# Altium schematic sheet Sheet2.SchDoc
size A0
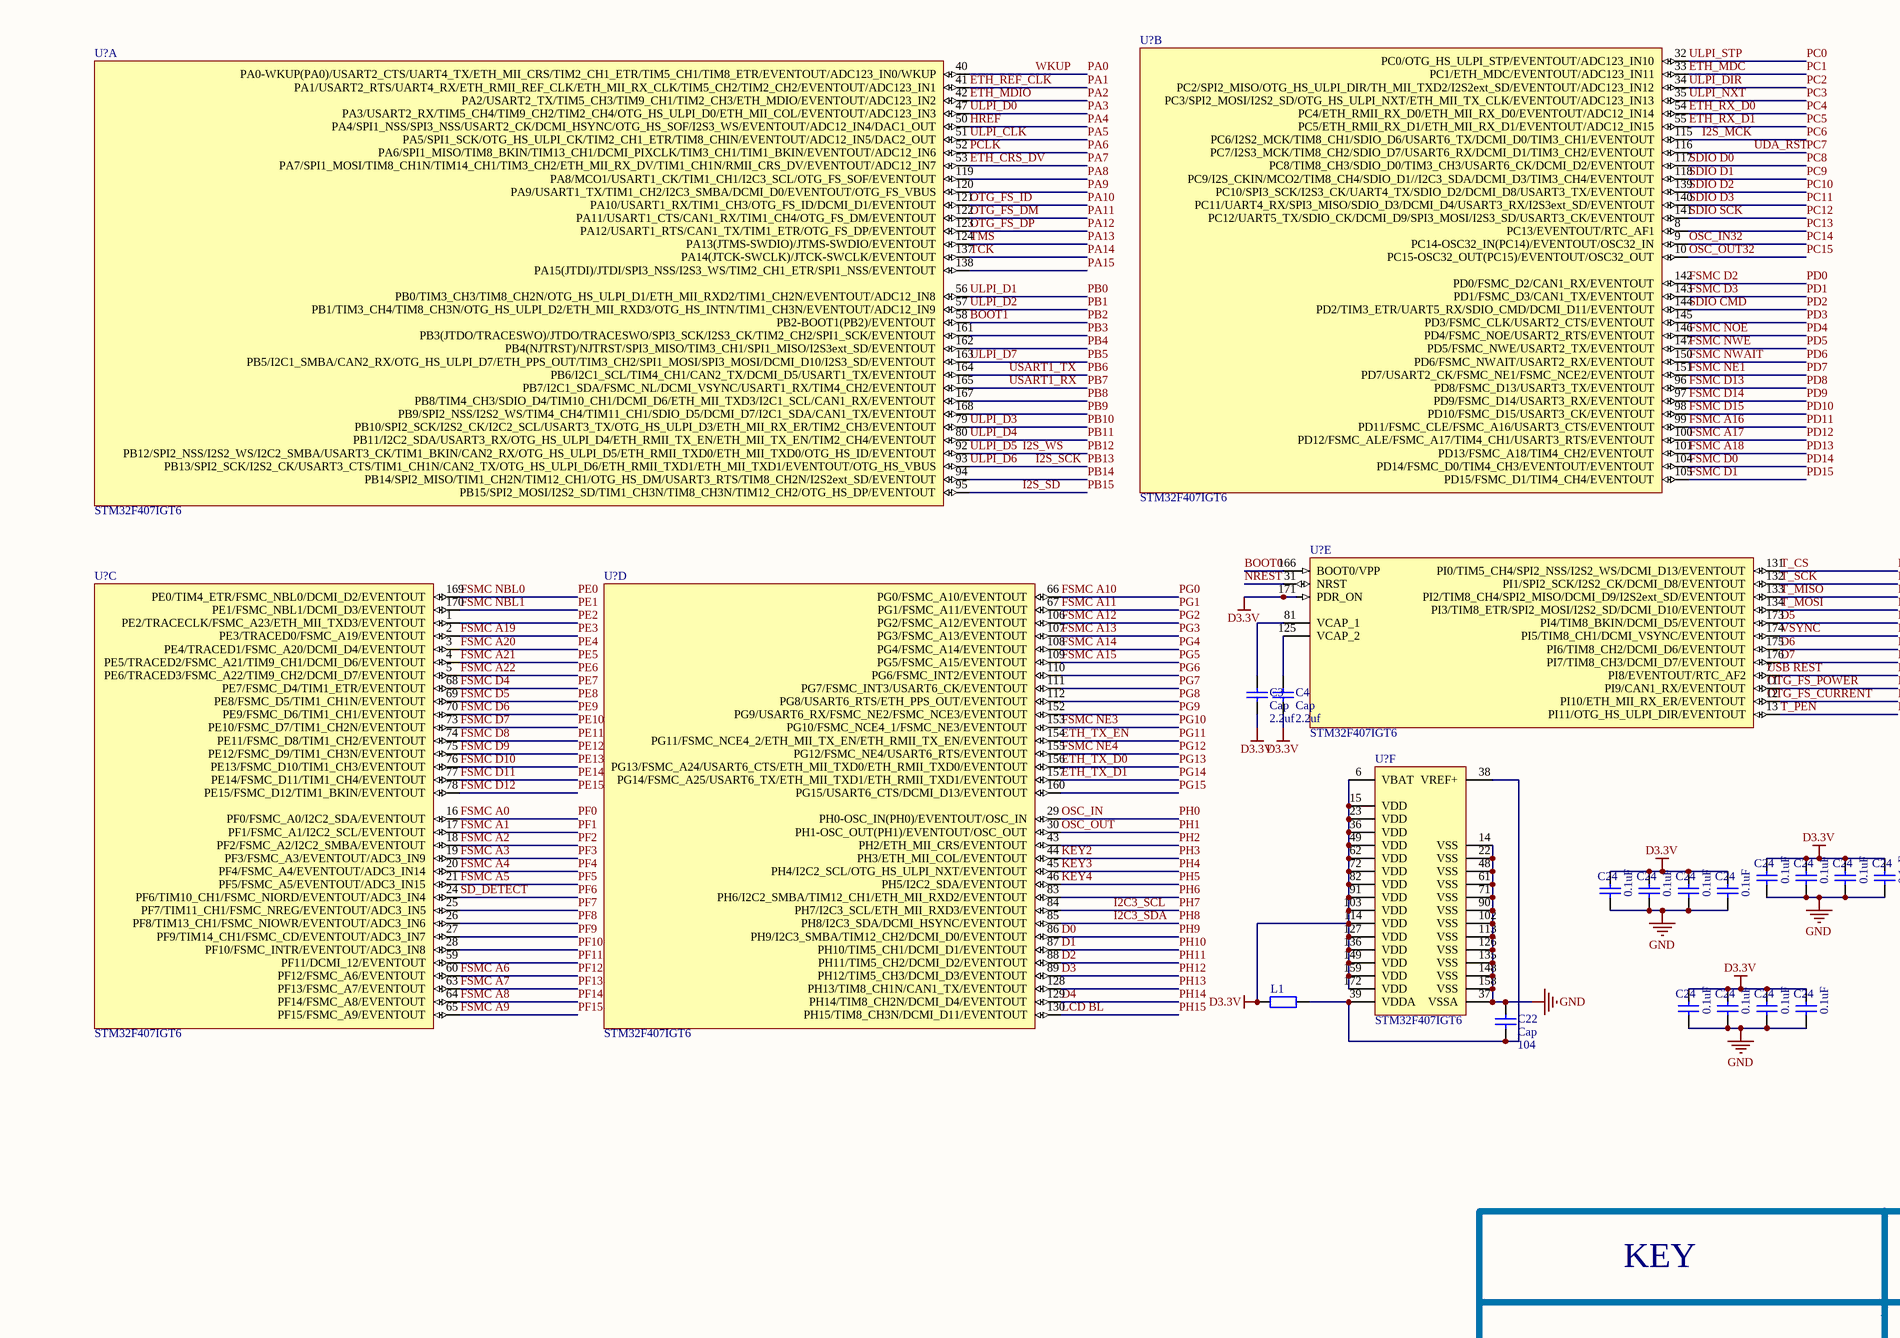
[diagram p0: Sheet2.SchDoc, top left]
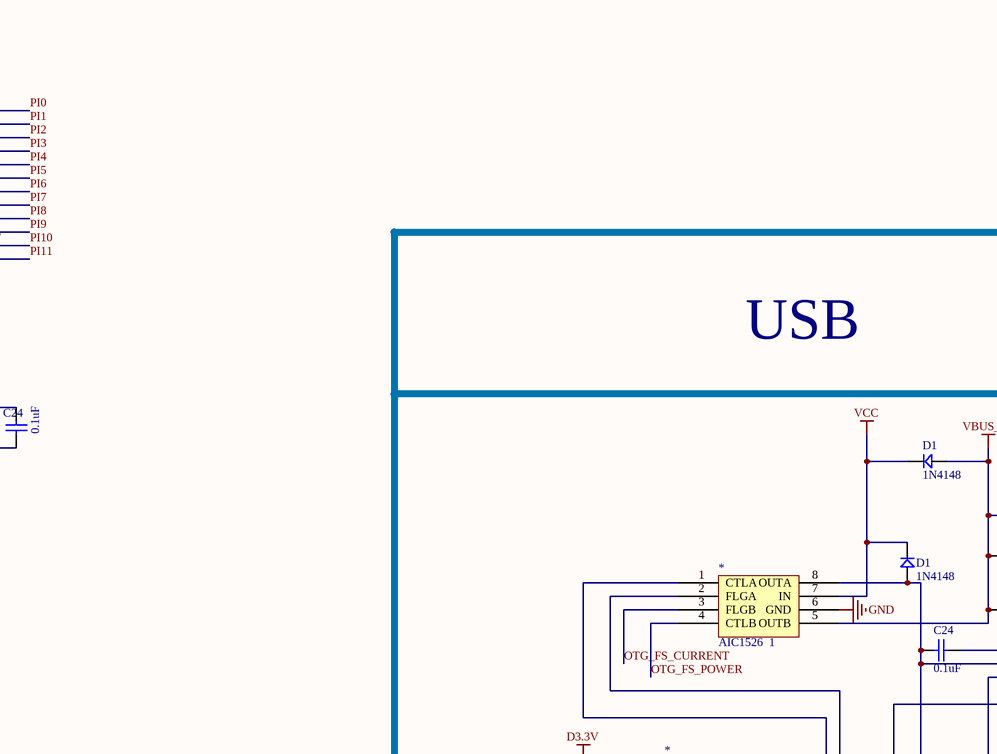
[diagram p1: Sheet2.SchDoc, top middle]
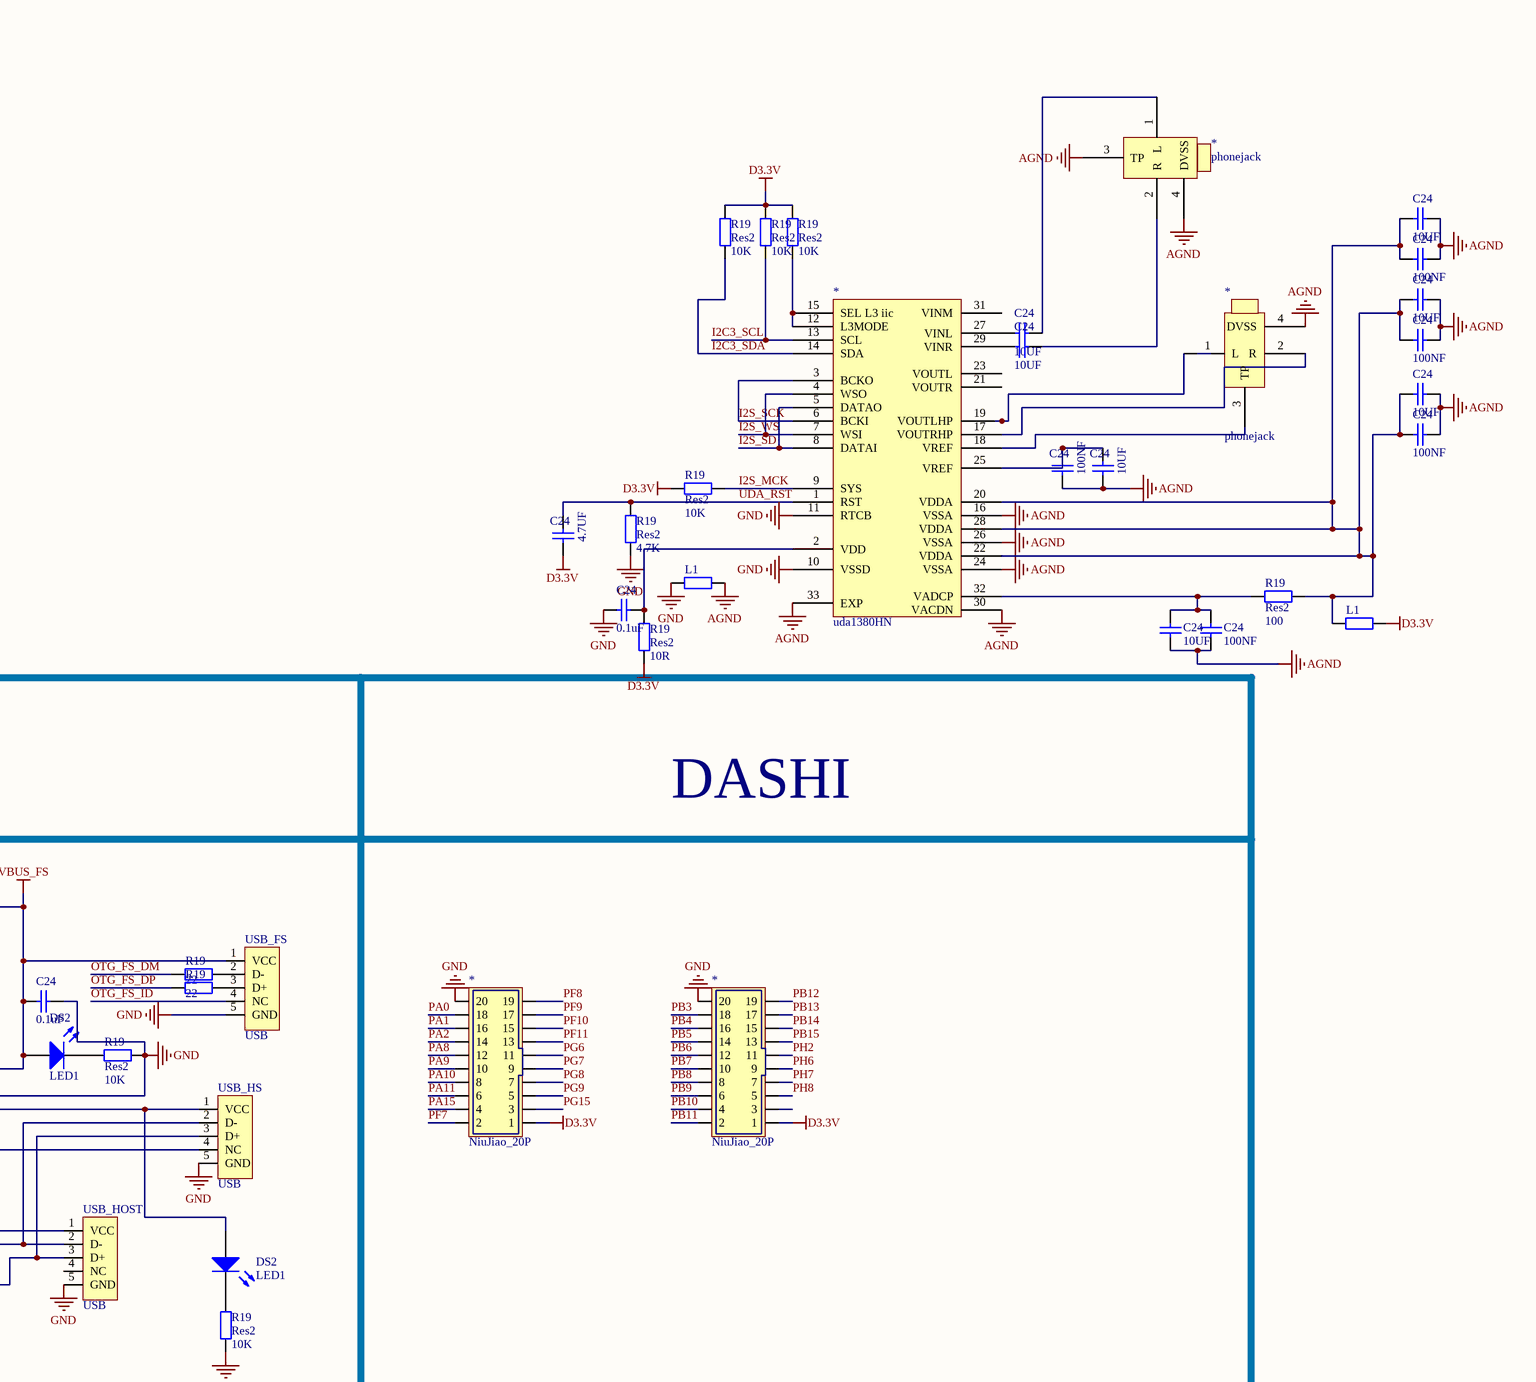
[diagram p2: Sheet2.SchDoc, top right]
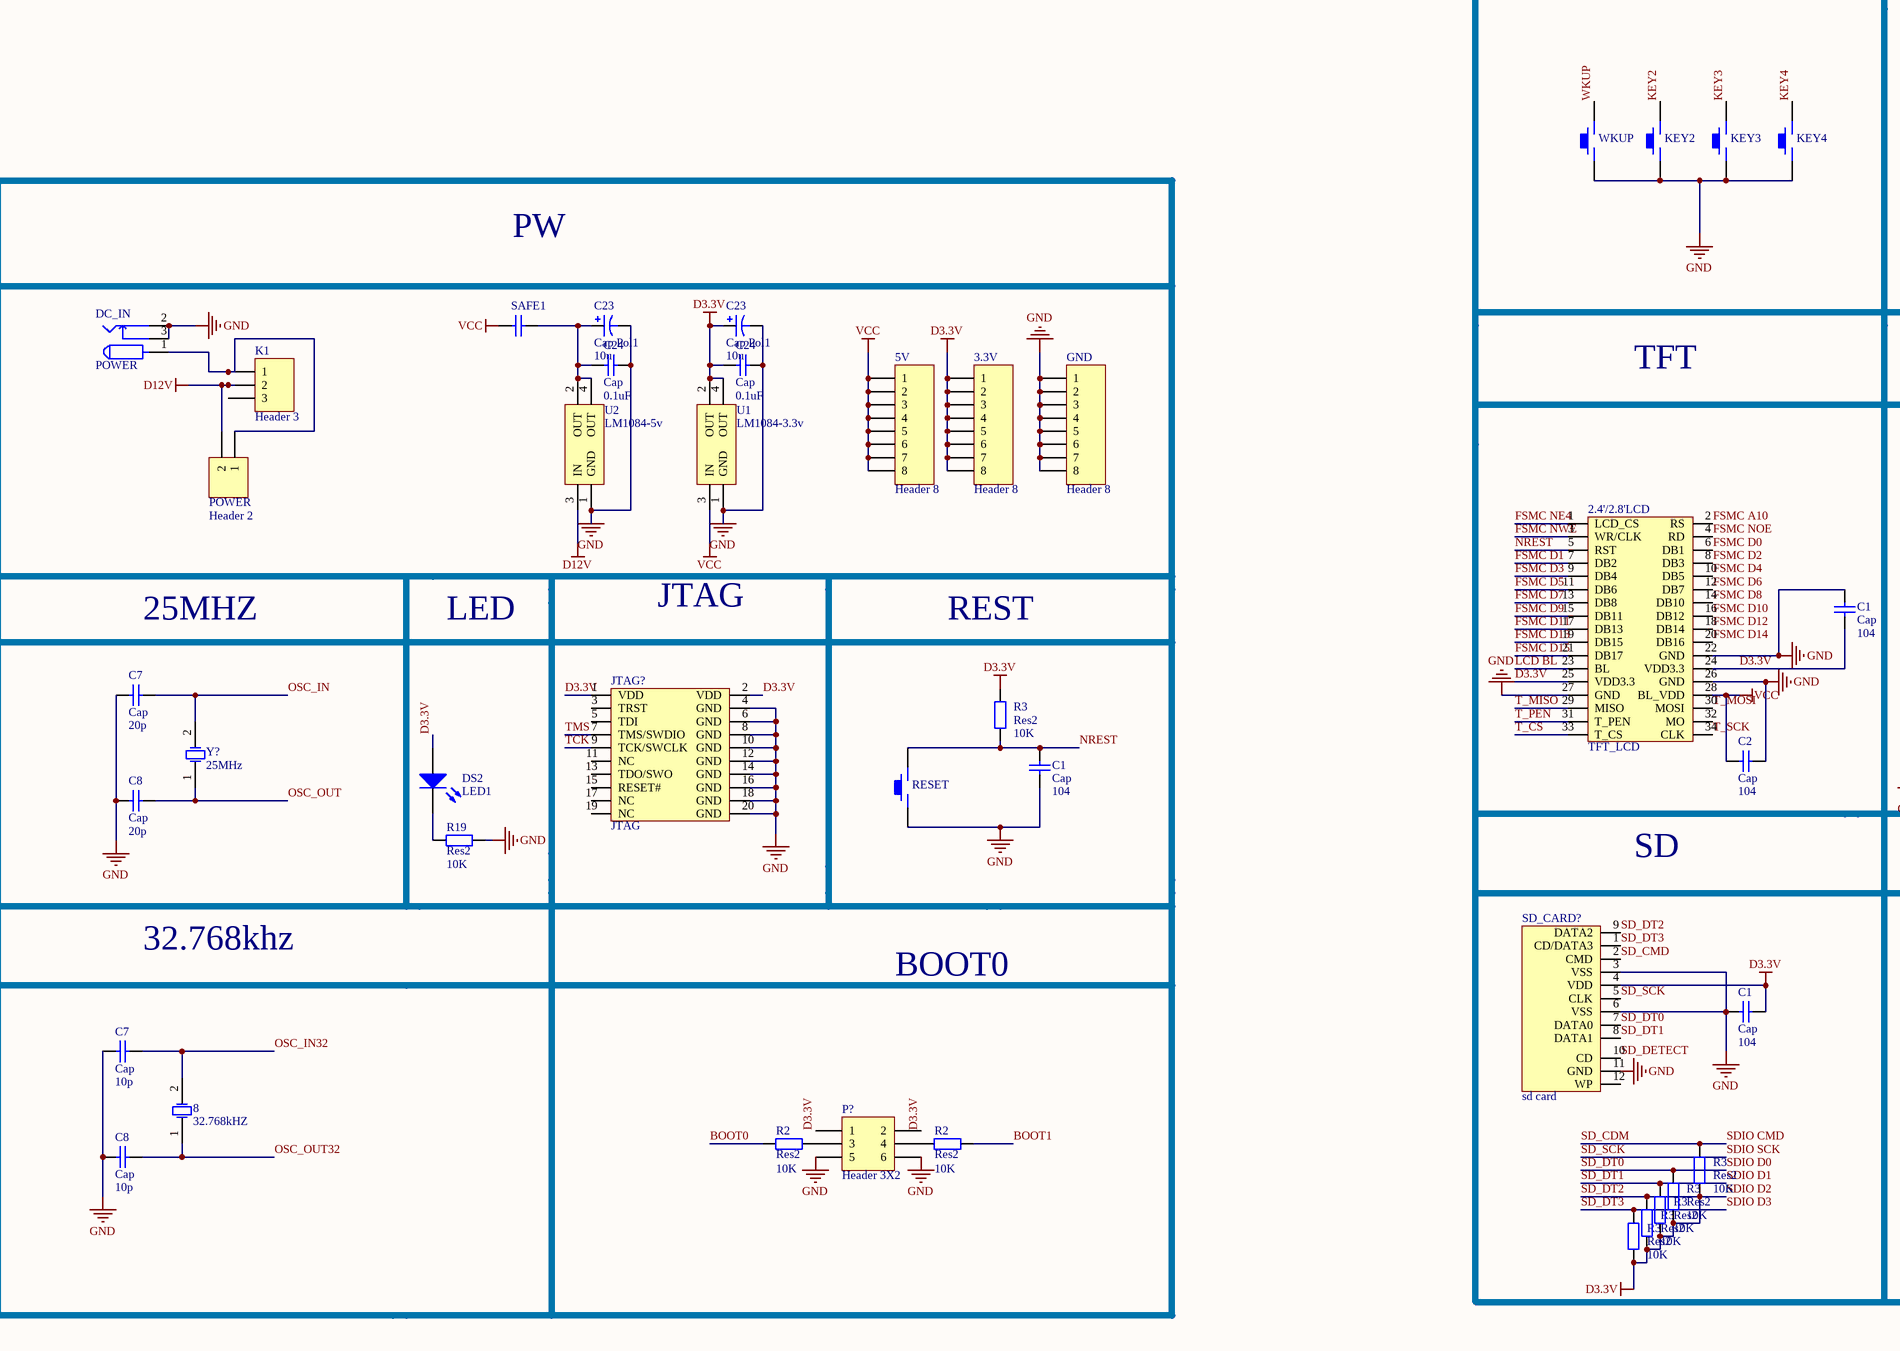
[diagram p3: Sheet2.SchDoc, bottom left]
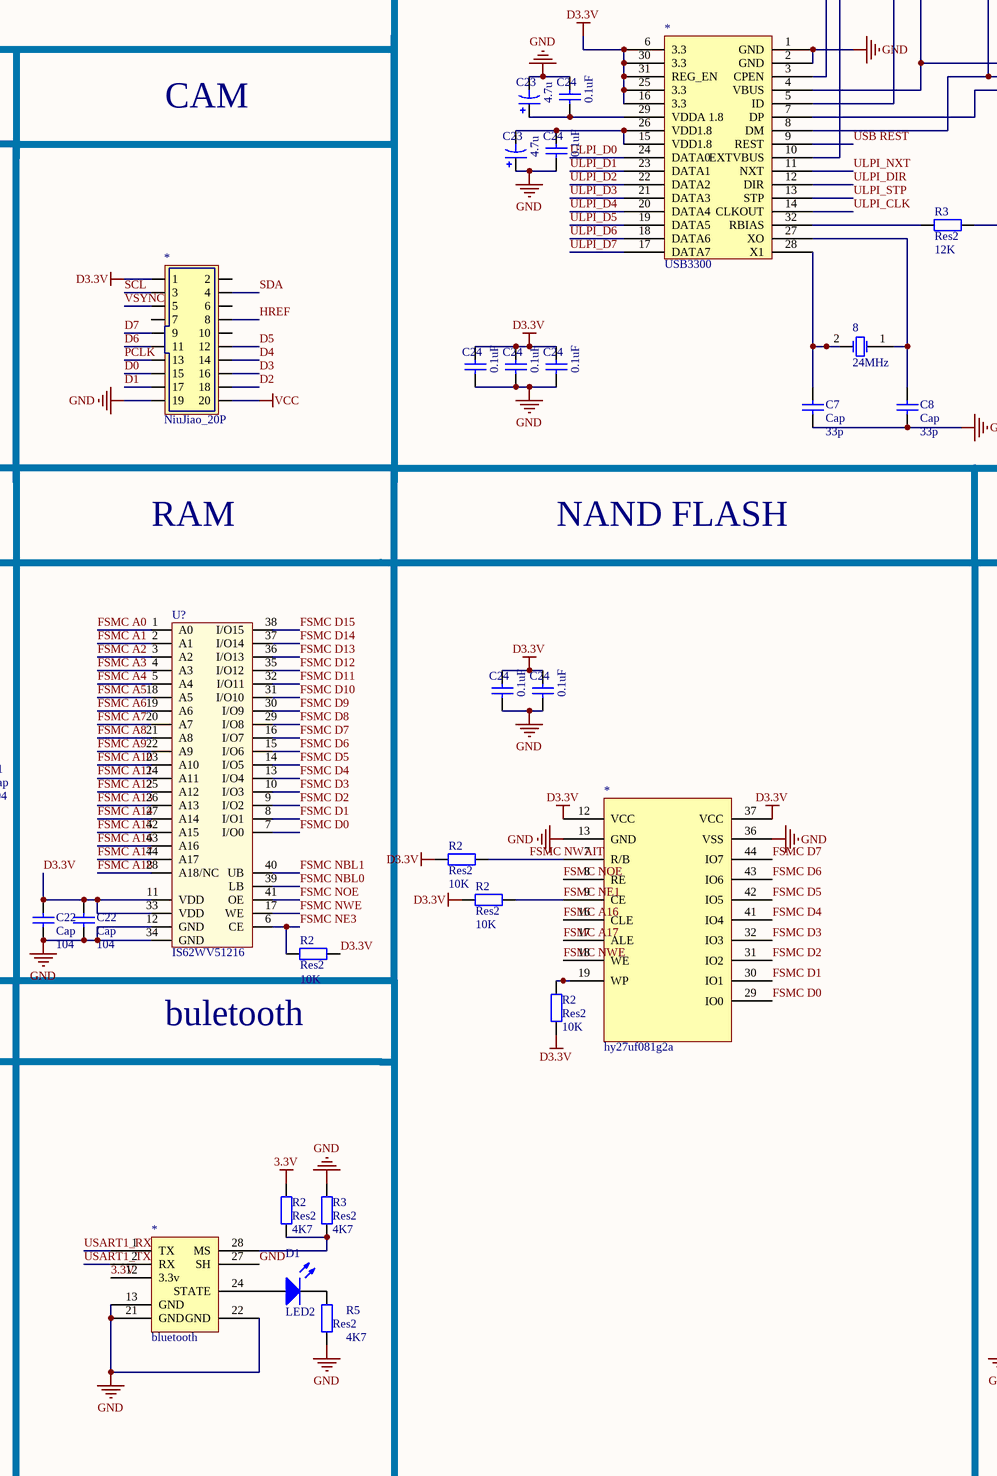
[diagram p4: Sheet2.SchDoc, bottom middle]
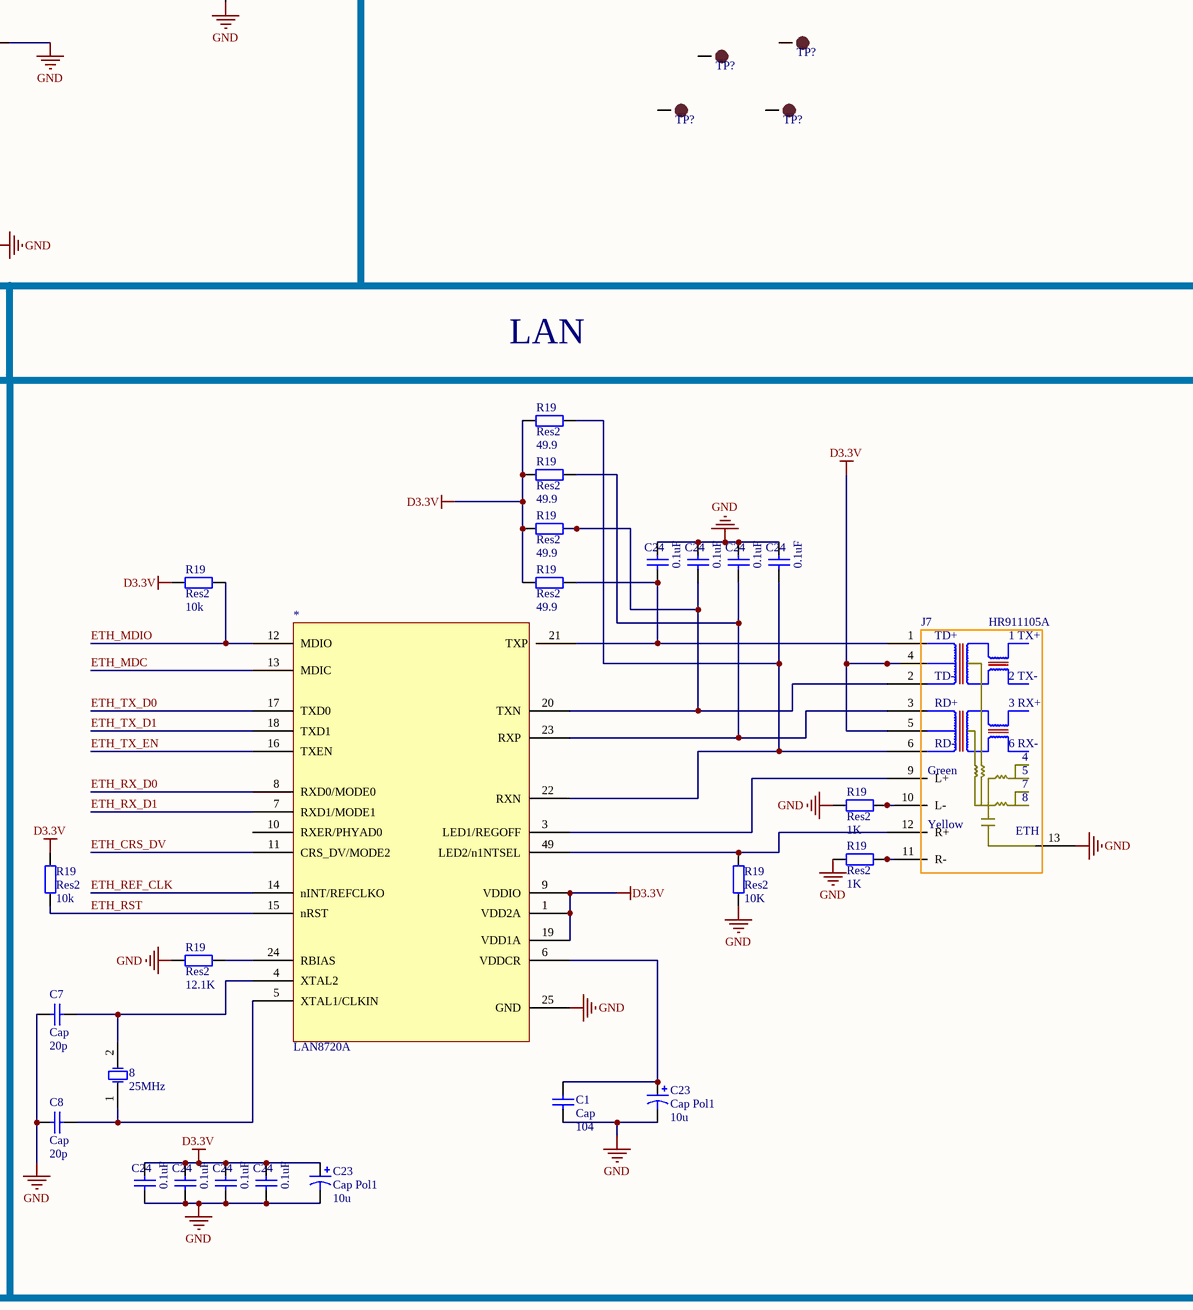
[diagram p5: Sheet2.SchDoc, bottom right]

## Parts
(Parts that share a designator on the sheet are numbered #1, #2 ... from top to bottom, then left to right.)
2.4'/2.8'LCD  TFT_LCD  [DB2*17]
3.3V  Header 8  [HDR1X8]
5V  Header 8  [HDR1X8]
8#1  24MHz  [XTAL_US]
8#2  25MHz  [XTAL_US]
8#3  32.768kHZ  [XTAL32]
*#1  phonejack
*#2  uda1380HN
*#3  phonejack
*#4  AIC1526  1
*#5  NiuJiao_20P  [JTAG_20]
*#6  NiuJiao_20P  [JTAG_20]
*#7  USB3300
*#8  NiuJiao_20P  [JTAG_20]
*#9  hy27uf081g2a
*#10  LAN8720A
*#11  bluetooth  [bluetooth - duplicate]
C1#1  Cap  value 104  [0805]
C1#2  Cap  value 104  [0805]
C1#3  Cap  value 104  [0805]
C1#4  Cap  value 104  [0805]
C2  Cap  value 104  [0805]
C3  Cap  value 2.2uf  [0805]
C4  Cap  value 2.2uf  [0805]
C7#1  Cap  value 33p  [0805]
C7#2  Cap  value 20p  [0805]
C7#3  Cap  value 20p  [0805]
C7#4  Cap  value 10p  [0805]
C8#1  Cap  value 33p  [0805]
C8#2  Cap  value 20p  [0805]
C8#3  Cap  value 20p  [0805]
C8#4  Cap  value 10p  [0805]
C22#1  Cap  value 104  [0805]
C22#2  Cap  value 104  [0805]
C22#3  Cap  value 104  [0805]
C23#1  value 4.7u  [1206钽电容]
C23#2  value 4.7u  [1206钽电容]
C23#3  Cap Pol1  value 10u  [1206钽电容]
C23#4  Cap Pol1  value 10u  [1206钽电容]
C23#5  Cap Pol1  value 10u  [1206钽电容]
C23#6  Cap Pol1  value 10u  [PCBCom- duplicate]
C24#1  value 10UF  [0805]
C24#2  value 100NF  [0805]
C24#3  value 10UF  [0805]
C24#4  value 10UF  [0805]
C24#5  value 100NF  [0805]
C24#6  value 10UF  [0805]
C24#7  value 10UF  [0805]
C24#8  value 100NF  [0805]
C24#9  value 100NF  [0805]
C24#10  value 10UF  [0805]
C24#11  value 4.7UF  [0805]
C24#12  value 0.1uF  [0805]
C24#13  value 10UF  [0805]
C24#14  value 100NF  [0805]
C24#15  value 0.1uF  [0805]
C24#16  value 0.1uF  [0805]
C24#17  value 0.1uF  [0805]
C24#18  value 0.1uF  [0805]
C24#19  value 0.1uF  [0805]
C24#20  value 0.1uF  [0805]
C24#21  value 0.1uF  [0805]
C24#22  value 0.1uF  [0805]
C24#23  value 0.1uF  [0805]
C24#24  value 0.1uF  [0805]
C24#25  value 0.1uF  [0805]
C24#26  value 0.1uF  [0805]
C24#27  value 0.1uF  [0805]
C24#28  value 0.1uF  [0805]
C24#29  value 0.1uF  [0805]
C24#30  value 0.1uF  [0805]
C24#31  value 0.1uF  [0805]
C24#32  value 0.1uF  [0805]
C24#33  value 0.1uF  [0805]
C24#34  Cap  value 0.1uF  [0805]
C24#35  Cap  value 0.1uF  [0805]
C24#36  value 0.1uF  [0805]
C24#37  value 0.1uF  [0805]
C24#38  value 0.1uF  [0805]
C24#39  value 0.1uF  [0805]
C24#40  value 0.1uF  [0805]
C24#41  value 0.1uF  [0805]
C24#42  value 0.1uF  [0805]
C24#43  value 0.1uF  [0805]
C24#44  value 0.1uF  [0805]
C24#45  value 0.1uF  [0805]
D1#1  1N4148  [1N4148]
D1#2  1N4148  [1N4148]
D1#3  LED2  [0805_LED]
DC_IN  POWER  [DC10B]
DS2#1  LED1  [0805_LED]
DS2#2  LED1  [0805_LED]
DS2#3  LED1  [0805_LED]
GND  Header 8  [HDR1X8]
J7  HR911105A  [HR911105A]
JTAG?  JTAG  [JTAG_20]
K1  Header 3  [小船型开关117S]
KEY2  KEY_M  [SW-2]  (value not drawn)
KEY3  KEY_M  [SW-2]  (value not drawn)
KEY4  KEY_M  [SW-2]  (value not drawn)
L1#1  (no value)  [0805]
L1#2  (no value)  [0805]
L1#3  (no value)  [0805]
P?  Header 3X2  [HDR2X3]
POWER  Header 2  [HDR1X2]
R2#1  Res2  value 10K  [0805]
R2#2  Res2  value 10K  [0805]
R2#3  Res2  value 10K  [0805]
R2#4  Res2  value 10K  [0805]
R2#5  Res2  value 4K7  [0805]
R2#6  Res2  value 10K  [0805]
R2#7  Res2  value 10K  [0805]
R3#1  Res2  value 12K  [0805]
R3#2  Res2  value 10K  [0805]
R3#3  Res2  value 4K7  [0805]
R3#4  Res2  value 10K  [0805]
R3#5  Res2  value 10K  [0805]
R3#6  Res2  value 10K  [0805]
R3#7  Res2  value 10K  [0805]
R3#8  Res2  value 10K  [0805]
R5  Res2  value 4K7  [0805]
R19#1  Res2  value 10K  [0805]
R19#2  Res2  value 10K  [0805]
R19#3  Res2  value 10K  [0805]
R19#4  Res2  value 10K  [0805]
R19#5  Res2  value 4.7K  [0805]
R19#6  Res2  value 100  [0805]
R19#7  Res2  value 10R  [0805]
R19#8  value 22  [0805]
R19#9  value 22  [0805]
R19#10  Res2  value 10K  [0805]
R19#11  Res2  value 10K  [0805]
R19#12  Res2  value 49.9  [0805]
R19#13  Res2  value 49.9  [0805]
R19#14  Res2  value 49.9  [0805]
R19#15  Res2  value 10k  [0805]
R19#16  Res2  value 49.9  [0805]
R19#17  Res2  value 1K  [0805]
R19#18  Res2  value 10K  [0805]
R19#19  Res2  value 1K  [0805]
R19#20  Res2  value 10k  [0805]
R19#21  Res2  value 10K  [0805]
R19#22  Res2  value 12.1K  [0805]
RESET  KEY_M  [SW-2]  (value not drawn)
SAFE1  (no value)  [1812_Fuse]
SD_CARD?  sd card  [SDCARD_L]
TP?#1  TEST POINT  [TP-1.5]  (value not drawn)
TP?#2  TEST POINT  [TP-1.5]  (value not drawn)
TP?#3  TEST POINT  [TP-1.5]  (value not drawn)
TP?#4  TEST POINT  [TP-1.5]  (value not drawn)
U1  LM1084-3.3v  [TO_263]
U2  LM1084-5v  [TO_263]
U?#1  STM32F407IGT6  [LQFP176_N]  (part B of 6)
U?#2  STM32F407IGT6  [LQFP176_N]  (part A of 6)
U?#3  STM32F407IGT6  [LQFP176_N]  (part E of 6)
U?#4  STM32F407IGT6  [LQFP176_N]  (part C of 6)
U?#5  STM32F407IGT6  [LQFP176_N]  (part D of 6)
U?#6  STM32F407IGT6  [LQFP176_N]  (part F of 6)
U?#7  IS62WV51216  [TSOP44]
USB_FS  USB  [USB-MICRO-B]
USB_HOST  USB  [USB-A]
USB_HS  USB  [USB-MICRO-B]
WKUP  KEY_M  [SW-2]  (value not drawn)
Y?  25MHz  [XTAL_US]

## Nets
3.3V: *#11.12(3.3v) R2#5.1
AGND: *#1.3(TP) *#1.4(DVSS) *#2.16(VSSA) *#2.24(VSSA) *#2.26(VSSA) *#2.30(VACDN) *#2.33(EXP) *#3.4(DVSS) C24#1.2 C24#2.2 C24#3.2 C24#5.2 C24#7.2 C24#8.2 C24#9.2 C24#10.2 C24#13.1 C24#14.1 L1#1.2
D3.3V: 2.4'/2.8'LCD.24(VDD3.3) 2.4'/2.8'LCD.25(VDD3.3) 3.3V.1 3.3V.2 3.3V.3 3.3V.4 3.3V.5 3.3V.6 3.3V.7 3.3V.8 *#5.1 *#6.1 *#7.6(3.3) *#7.16(3.3) *#7.25(3.3) *#7.30(3.3) *#7.31(REG_EN) *#8.1 *#9.12(VCC) *#9.37(VCC) *#10.1(VDD2A) *#10.9(VDDIO) *#10.19(VDD1A) C1#1.2 C1#3.2 C3.1 C4.1 C22#2.2 C22#3.2 C23#4.1 C23#6.1 C24#11.2 C24#15.1 C24#16.1 C24#17.1 C24#18.1 C24#19.1 C24#20.1 C24#21.1 C24#22.1 C24#24.1 C24#25.1 C24#26.1 C24#27.1 C24#31.1 C24#32.1 C24#33.1 C24#35.2 C24#36.1 C24#37.1 C24#42.1 C24#43.1 C24#44.1 C24#45.1 DS2#3.1(A) J7.4 J7.5 JTAG?.1(VDD) JTAG?.2(VDD) L1#2.2 L1#3.1 P?.1 P?.2 R2#1.1 R2#2.1 R2#3.2 R2#4.1 R3#2.2 R3#4.1 R3#5.1 R3#6.1 R3#7.1 R3#7.2 R3#8.1 R19#1.2 R19#2.2 R19#3.2 R19#4.2 R19#7.2 R19#12.1 R19#13.1 R19#14.1 R19#15.1 R19#16.1 R19#20.2 SD_CARD?.4(VDD) SD_CARD?.9(DATA2) U1.2(OUT) U1.4(OUT) U?#1.139(PC10/SPI3_SCK/I2S3_CK/UART4_TX/SDIO_D2/DCMI_D8/USART3_TX/EVENTOUT) U?#3.171(PDR_ON) U?#6.6(VBAT) U?#6.15(VDD) U?#6.23(VDD) U?#6.36(VDD) U?#6.49(VDD) U?#6.62(VDD) U?#6.72(VDD) U?#6.82(VDD) U?#6.91(VDD) U?#6.103(VDD) U?#6.114(VDD) U?#6.127(VDD) U?#6.136(VDD) U?#6.149(VDD) U?#6.159(VDD) U?#6.172(VDD) U?#7.11(VDD) U?#7.33(VDD)  [also labelled PC10, SD_DT2, SDIO D2]
D12V: K1.2 POWER.2 U2.3(IN)
GND: 2.4'/2.8'LCD.22(GND) 2.4'/2.8'LCD.26(GND) 2.4'/2.8'LCD.27(GND) *#2.10(VSSD) *#2.11(RTCB) *#4.6(GND) *#5.20 *#6.20 *#7.1(GND) *#7.2(GND) *#8.19 *#9.13(GND) *#9.36(VSS) *#10.25(GND) *#11.13(GND) *#11.21(GND) *#11.22(GND) *#11.27(SH) C1#1.1 C1#2.1 C1#3.1 C1#4.1 C2.1 C7#1.2 C7#2.2 C7#3.2 C7#4.2 C8#1.2 C8#2.2 C8#3.2 C8#4.2 C22#1.2 C22#2.1 C22#3.1 C23#1.2 C23#2.1 C23#3.2 C23#4.2 C23#5.2 C23#6.2 C24#12.1 C24#15.2 C24#16.2 C24#17.2 C24#18.2 C24#19.2 C24#20.2 C24#21.2 C24#22.2 C24#23.2 C24#24.2 C24#25.2 C24#26.2 C24#27.2 C24#28.2 C24#29.1 C24#30.2 C24#31.2 C24#32.2 C24#33.2 C24#34.1 C24#35.1 C24#36.2 C24#37.2 C24#38.1 C24#39.1 C24#40.1 C24#41.1 C24#42.2 C24#43.2 C24#44.2 C24#45.2 DC_IN.2 DC_IN.3 GND.1 GND.2 GND.3 GND.4 GND.5 GND.6 GND.7 GND.8 J7.13 JTAG?.4(GND) JTAG?.6(GND) JTAG?.8(GND) JTAG?.10(GND) JTAG?.12(GND) JTAG?.14(GND) JTAG?.16(GND) JTAG?.18(GND) JTAG?.20(GND) KEY2.1 KEY3.1 KEY4.1 L1#1.1 P?.5 P?.6 R3#1.2 R3#3.1 R5.1 R19#5.2 R19#10.2 R19#11.2 R19#17.1 R19#18.2 R19#19.1 R19#21.1 R19#22.1 RESET.1 SD_CARD?.3(VSS) SD_CARD?.6(VSS) SD_CARD?.11(GND) U1.1(GND) U2.1(GND) U?#6.14(VSS) U?#6.22(VSS) U?#6.37(VSSA) U?#6.48(VSS) U?#6.61(VSS) U?#6.71(VSS) U?#6.90(VSS) U?#6.102(VSS) U?#6.113(VSS) U?#6.126(VSS) U?#6.135(VSS) U?#6.148(VSS) U?#6.158(VSS) U?#7.12(GND) U?#7.34(GND) USB_FS.5(GND) USB_HOST.5(GND) USB_HS.5(GND) WKUP.1
VBUS_FS: *#4.5(OUTB) C24#23.1 D1#1.1 DS2#1.1(A) USB_FS.1(VCC)
VCC: 2.4'/2.8'LCD.28(BL_VDD) 5V.1 5V.2 5V.3 5V.4 5V.5 5V.6 5V.7 5V.8 *#4.7(IN) *#8.20 C2.2 D1#1.2 D1#2.2 SAFE1.2 U1.3(IN)
BOOT0: R2#6.1 U?#3.166(BOOT0/VPP)
BOOT1: R2#7.2 U?#2.58(PB2-BOOT1(PB2)/EVENTOUT)  [also labelled PB2]
D0: *#8.15 U?#5.86(PH9/I2C3_SMBA/TIM12_CH2/DCMI_D0/EVENTOUT)  [also labelled PH9]
D1: *#8.17 U?#5.87(PH10/TIM5_CH1/DCMI_D1/EVENTOUT)  [also labelled PH10]
D2: *#8.18 U?#5.88(PH11/TIM5_CH2/DCMI_D2/EVENTOUT)  [also labelled PH11]
D3: *#8.16 U?#5.89(PH12/TIM5_CH3/DCMI_D3/EVENTOUT)  [also labelled PH12]
D4: *#8.14 U?#5.129(PH14/TIM8_CH2N/DCMI_D4/EVENTOUT)  [also labelled PH14]
D5: *#8.12 U?#3.173(PI4/TIM8_BKIN/DCMI_D5/EVENTOUT)  [also labelled PI4]
D6: *#8.11 U?#3.175(PI6/TIM8_CH2/DCMI_D6/EVENTOUT)  [also labelled PI6]
D7: *#8.9 U?#3.176(PI7/TIM8_CH3/DCMI_D7/EVENTOUT)  [also labelled PI7]
ETH_CRS_DV: *#10.11(CRS_DV/MODE2) U?#2.53(PA7/SPI1_MOSI/TIM8_CH1N/TIM14_CH1/TIM3_CH2/ETH_MII_RX_DV/TIM1_CH1N/RMII_CRS_DV/EVENTOUT/ADC12_IN7)  [also labelled PA7]
ETH_MDC: *#10.13(MDIC) U?#1.33(PC1/ETH_MDC/EVENTOUT/ADC123_IN11)  [also labelled PC1]
ETH_MDIO: *#5.14 *#10.12(MDIO) R19#15.2 U?#2.42(PA2/USART2_TX/TIM5_CH3/TIM9_CH1/TIM2_CH3/ETH_MDIO/EVENTOUT/ADC123_IN2)  [also labelled PA2]
ETH_REF_CLK: *#5.16 *#10.14(nINT/REFCLKO) U?#2.41(PA1/USART2_RTS/UART4_RX/ETH_RMII_REF_CLK/ETH_MII_RX_CLK/TIM5_CH2/TIM2_CH2/EVENTOUT/ADC123_IN1)  [also labelled PA1]
ETH_RST: *#10.15(nRST) R19#20.1
ETH_RX_D0: *#10.8(RXD0/MODE0) U?#1.54(PC4/ETH_RMII_RX_D0/ETH_MII_RX_D0/EVENTOUT/ADC12_IN14)  [also labelled PC4]
ETH_RX_D1: *#10.7(RXD1/MODE1) U?#1.55(PC5/ETH_RMII_RX_D1/ETH_MII_RX_D1/EVENTOUT/ADC12_IN15)  [also labelled PC5]
ETH_TX_D0: *#10.17(TXD0) U?#5.156(PG13/FSMC_A24/USART6_CTS/ETH_MII_TXD0/ETH_RMII_TXD0/EVENTOUT)  [also labelled PG13]
ETH_TX_D1: *#10.18(TXD1) U?#5.157(PG14/FSMC_A25/USART6_TX/ETH_MII_TXD1/ETH_RMII_TXD1/EVENTOUT)  [also labelled PG14]
ETH_TX_EN: *#10.16(TXEN) U?#5.154(PG11/FSMC_NCE4_2/ETH_MII_TX_EN/ETH_RMII_TX_EN/EVENTOUT)  [also labelled PG11]
FSMC A0: U?#4.16(PF0/FSMC_A0/I2C2_SDA/EVENTOUT) U?#7.1(A0)  [also labelled PF0]
FSMC A1: U?#4.17(PF1/FSMC_A1/I2C2_SCL/EVENTOUT) U?#7.2(A1)  [also labelled PF1]
FSMC A2: U?#4.18(PF2/FSMC_A2/I2C2_SMBA/EVENTOUT) U?#7.3(A2)  [also labelled PF2]
FSMC A3: U?#4.19(PF3/FSMC_A3/EVENTOUT/ADC3_IN9) U?#7.4(A3)  [also labelled PF3]
FSMC A4: U?#4.20(PF4/FSMC_A4/EVENTOUT/ADC3_IN14) U?#7.5(A4)  [also labelled PF4]
FSMC A5: U?#4.21(PF5/FSMC_A5/EVENTOUT/ADC3_IN15) U?#7.18(A5)  [also labelled PF5]
FSMC A6: U?#4.60(PF12/FSMC_A6/EVENTOUT) U?#7.19(A6)  [also labelled PF12]
FSMC A7: U?#4.63(PF13/FSMC_A7/EVENTOUT) U?#7.20(A7)  [also labelled PF13]
FSMC A8: U?#4.64(PF14/FSMC_A8/EVENTOUT) U?#7.21(A8)  [also labelled PF14]
FSMC A9: U?#4.65(PF15/FSMC_A9/EVENTOUT) U?#7.22(A9)  [also labelled PF15]
FSMC A10: 2.4'/2.8'LCD.2(RS) U?#5.66(PG0/FSMC_A10/EVENTOUT) U?#7.23(A10)  [also labelled PG0]
FSMC A11: U?#5.67(PG1/FSMC_A11/EVENTOUT) U?#7.24(A11)  [also labelled PG1]
FSMC A12: U?#5.106(PG2/FSMC_A12/EVENTOUT) U?#7.25(A12)  [also labelled PG2]
FSMC A13: U?#5.107(PG3/FSMC_A13/EVENTOUT) U?#7.26(A13)  [also labelled PG3]
FSMC A14: U?#5.108(PG4/FSMC_A14/EVENTOUT) U?#7.27(A14)  [also labelled PG4]
FSMC A15: U?#5.109(PG5/FSMC_A15/EVENTOUT) U?#7.42(A15)  [also labelled PG5]
FSMC A16: *#9.16(CLE) U?#1.99(PD11/FSMC_CLE/FSMC_A16/USART3_CTS/EVENTOUT) U?#7.43(A16)  [also labelled PD11]
FSMC A17: *#9.17(ALE) U?#1.100(PD12/FSMC_ALE/FSMC_A17/TIM4_CH1/USART3_RTS/EVENTOUT) U?#7.44(A17)  [also labelled PD12]
FSMC A18: U?#1.101(PD13/FSMC_A18/TIM4_CH2/EVENTOUT) U?#7.28(A18/NC)  [also labelled PD13]
FSMC A19: U?#4.2(PE3/TRACED0/FSMC_A19/EVENTOUT)  [also labelled PE3]
FSMC A20: U?#4.3(PE4/TRACED1/FSMC_A20/DCMI_D4/EVENTOUT)  [also labelled PE4]
FSMC A21: U?#4.4(PE5/TRACED2/FSMC_A21/TIM9_CH1/DCMI_D6/EVENTOUT)  [also labelled PE5]
FSMC A22: U?#4.5(PE6/TRACED3/FSMC_A22/TIM9_CH2/DCMI_D7/EVENTOUT)  [also labelled PE6]
FSMC D0: 2.4'/2.8'LCD.6(DB1) *#9.29(IO0) U?#1.104(PD14/FSMC_D0/TIM4_CH3/EVENTOUT/EVENTOUT) U?#7.7(I/O0)  [also labelled PD14]
FSMC D1: 2.4'/2.8'LCD.7(DB2) *#9.30(IO1) U?#1.105(PD15/FSMC_D1/TIM4_CH4/EVENTOUT) U?#7.8(I/O1)  [also labelled PD15]
FSMC D2: 2.4'/2.8'LCD.8(DB3) *#9.31(IO2) U?#1.142(PD0/FSMC_D2/CAN1_RX/EVENTOUT) U?#7.9(I/O2)  [also labelled PD0]
FSMC D3: 2.4'/2.8'LCD.9(DB4) *#9.32(IO3) U?#1.143(PD1/FSMC_D3/CAN1_TX/EVENTOUT) U?#7.10(I/O3)  [also labelled PD1]
FSMC D4: 2.4'/2.8'LCD.10(DB5) *#9.41(IO4) U?#4.68(PE7/FSMC_D4/TIM1_ETR/EVENTOUT) U?#7.13(I/O4)  [also labelled PE7]
FSMC D5: 2.4'/2.8'LCD.11(DB6) *#9.42(IO5) U?#4.69(PE8/FSMC_D5/TIM1_CH1N/EVENTOUT) U?#7.14(I/O5)  [also labelled PE8]
FSMC D6: 2.4'/2.8'LCD.12(DB7) *#9.43(IO6) U?#4.70(PE9/FSMC_D6/TIM1_CH1/EVENTOUT) U?#7.15(I/O6)  [also labelled PE9]
FSMC D7: 2.4'/2.8'LCD.13(DB8) *#9.44(IO7) U?#4.73(PE10/FSMC_D7/TIM1_CH2N/EVENTOUT) U?#7.16(I/O7)  [also labelled PE10]
FSMC D8: 2.4'/2.8'LCD.14(DB10) U?#4.74(PE11/FSMC_D8/TIM1_CH2/EVENTOUT) U?#7.29(I/O8)  [also labelled PE11]
FSMC D9: 2.4'/2.8'LCD.15(DB11) U?#4.75(PE12/FSMC_D9/TIM1_CH3N/EVENTOUT) U?#7.30(I/O9)  [also labelled PE12]
FSMC D10: 2.4'/2.8'LCD.16(DB12) U?#4.76(PE13/FSMC_D10/TIM1_CH3/EVENTOUT) U?#7.31(I/O10)  [also labelled PE13]
FSMC D11: 2.4'/2.8'LCD.17(DB13) U?#4.77(PE14/FSMC_D11/TIM1_CH4/EVENTOUT) U?#7.32(I/O11)  [also labelled PE14]
FSMC D12: 2.4'/2.8'LCD.18(DB14) U?#4.78(PE15/FSMC_D12/TIM1_BKIN/EVENTOUT) U?#7.35(I/O12)  [also labelled PE15]
FSMC D13: 2.4'/2.8'LCD.19(DB15) U?#1.96(PD8/FSMC_D13/USART3_TX/EVENTOUT) U?#7.36(I/O13)  [also labelled PD8]
FSMC D14: 2.4'/2.8'LCD.20(DB16) U?#1.97(PD9/FSMC_D14/USART3_RX/EVENTOUT) U?#7.37(I/O14)  [also labelled PD9]
FSMC D15: 2.4'/2.8'LCD.21(DB17) U?#1.98(PD10/FSMC_D15/USART3_CK/EVENTOUT) U?#7.38(I/O15)  [also labelled PD10]
FSMC NBL0: U?#4.169(PE0/TIM4_ETR/FSMC_NBL0/DCMI_D2/EVENTOUT) U?#7.39(LB)  [also labelled PE0]
FSMC NBL1: U?#4.170(PE1/FSMC_NBL1/DCMI_D3/EVENTOUT) U?#7.40(UB)  [also labelled PE1]
FSMC NE1: *#9.9(CE) R2#2.2 U?#1.151(PD7/USART2_CK/FSMC_NE1/FSMC_NCE2/EVENTOUT)  [also labelled PD7]
FSMC NE3: R2#3.1 U?#5.153(PG10/FSMC_NCE4_1/FSMC_NE3/EVENTOUT) U?#7.6(CE)  [also labelled PG10]
FSMC NE4: 2.4'/2.8'LCD.1(LCD_CS) U?#5.155(PG12/FSMC_NE4/USART6_RTS/EVENTOUT)  [also labelled PG12]
FSMC NOE: 2.4'/2.8'LCD.4(RD) *#9.8(RE) U?#1.146(PD4/FSMC_NOE/USART2_RTS/EVENTOUT) U?#7.41(OE)  [also labelled PD4]
FSMC NWAIT: *#9.7(R/B) R2#1.2 U?#1.150(PD6/FSMC_NWAIT/USART2_RX/EVENTOUT)  [also labelled PD6]
FSMC NWE: 2.4'/2.8'LCD.3(WR/CLK) *#9.18(WE) U?#1.147(PD5/FSMC_NWE/USART2_TX/EVENTOUT) U?#7.17(WE)  [also labelled PD5]
HREF: *#8.8 U?#2.50(PA4/SPI1_NSS/SPI3_NSS/USART2_CK/DCMI_HSYNC/OTG_HS_SOF/I2S3_WS/EVENTOUT/ADC12_IN4/DAC1_OUT)  [also labelled PA4]
I2C3_SCL: *#2.13(SCL) *#6.7 R19#2.1 U?#5.84(PH7/I2C3_SCL/ETH_MII_RXD3/EVENTOUT)  [also labelled PH7]
I2C3_SDA: *#2.14(SDA) *#6.5 R19#1.1 U?#5.85(PH8/I2C3_SDA/DCMI_HSYNC/EVENTOUT)  [also labelled PH8]
I2S_MCK: *#2.9(SYS) R19#4.1 U?#1.115(PC6/I2S2_MCK/TIM8_CH1/SDIO_D6/USART6_TX/DCMI_D0/TIM3_CH1/EVENTOUT)  [also labelled PC6]
I2S_SCK: *#2.3(BCKO) *#2.6(BCKI) *#6.17 *#7.18(DATA6) U?#2.93(PB13/SPI2_SCK/I2S2_CK/USART3_CTS/TIM1_CH1N/CAN2_TX/OTG_HS_ULPI_D6/ETH_RMII_TXD1/ETH_MII_TXD1/EVENTOUT/OTG_HS_VBUS)  [also labelled PB13, ULPI_D6]
I2S_SD: *#2.5(DATAO) *#2.8(DATAI) *#6.13 U?#2.95(PB15/SPI2_MOSI/I2S2_SD/TIM1_CH3N/TIM8_CH3N/TIM12_CH2/OTG_HS_DP/EVENTOUT)  [also labelled PB15]
I2S_WS: *#2.4(WSO) *#2.7(WSI) *#6.19 *#7.19(DATA5) U?#2.92(PB12/SPI2_NSS/I2S2_WS/I2C2_SMBA/USART3_CK/TIM1_BKIN/CAN2_RX/OTG_HS_ULPI_D5/ETH_RMII_TXD0/ETH_MII_TXD0/OTG_HS_ID/EVENTOUT)  [also labelled PB12, ULPI_D5]
KEY2: KEY2.2 U?#5.44(PH3/ETH_MII_COL/EVENTOUT)  [also labelled PH3]
KEY3: KEY3.2 U?#5.45(PH4/I2C2_SCL/OTG_HS_ULPI_NXT/EVENTOUT)  [also labelled PH4]
KEY4: KEY4.2 U?#5.46(PH5/I2C2_SDA/EVENTOUT)  [also labelled PH5]
LCD BL: 2.4'/2.8'LCD.23(BL) U?#5.130(PH15/TIM8_CH3N/DCMI_D11/EVENTOUT)  [also labelled PH15]
NREST: 2.4'/2.8'LCD.5(RST) C1#2.2 R3#2.1 RESET.2 U?#3.31(NRST)
OSC_IN: C7#2.1 U?#5.29(PH0-OSC_IN(PH0)/EVENTOUT/OSC_IN) Y?.2(OSC2)  [also labelled PH0]
OSC_IN32: 8#3.2(OSC2) C7#4.1 U?#1.9(PC14-OSC32_IN(PC14)/EVENTOUT/OSC32_IN)  [also labelled PC14]
OSC_OUT: C8#2.1 U?#5.30(PH1-OSC_OUT(PH1)/EVENTOUT/OSC_OUT) Y?.1(OSC1)  [also labelled PH1]
OSC_OUT32: 8#3.1(OSC1) C8#4.1 U?#1.10(PC15-OSC32_OUT(PC15)/EVENTOUT/OSC32_OUT)  [also labelled PC15]
OTG_FS_CURRENT: *#4.3(FLGB)
OTG_FS_DM: *#5.6 R19#8.1 U?#2.122(PA11/USART1_CTS/CAN1_RX/TIM1_CH4/OTG_FS_DM/EVENTOUT)  [also labelled PA11]
OTG_FS_DP: R19#9.1 U?#2.123(PA12/USART1_RTS/CAN1_TX/TIM1_ETR/OTG_FS_DP/EVENTOUT)  [also labelled PA12]
OTG_FS_ID: *#5.8 U?#2.121(PA10/USART1_RX/TIM1_CH3/OTG_FS_ID/DCMI_D1/EVENTOUT) USB_FS.4(NC)  [also labelled PA10]
OTG_FS_POWER: *#4.4(CTLB)
PA0: *#5.18 U?#2.40(PA0-WKUP(PA0)/USART2_CTS/UART4_TX/ETH_MII_CRS/TIM2_CH1_ETR/TIM5_CH1/TIM8_ETR/EVENTOUT/ADC123_IN0/WKUP) WKUP.2  [also labelled WKUP]
PA3: *#7.24(DATA0) U?#2.47(PA3/USART2_RX/TIM5_CH4/TIM9_CH2/TIM2_CH4/OTG_HS_ULPI_D0/ETH_MII_COL/EVENTOUT/ADC123_IN3)  [also labelled ULPI_D0]
PA5: *#7.14(CLKOUT) U?#2.51(PA5/SPI1_SCK/OTG_HS_ULPI_CK/TIM2_CH1_ETR/TIM8_CHIN/EVENTOUT/ADC12_IN5/DAC2_OUT)  [also labelled ULPI_CLK]
PA6: *#8.13 U?#2.52(PA6/SPI1_MISO/TIM8_BKIN/TIM13_CH1/DCMI_PIXCLK/TIM3_CH1/TIM1_BKIN/EVENTOUT/ADC12_IN6)  [also labelled PCLK]
PA8: *#5.12 U?#2.119(PA8/MCO1/USART1_CK/TIM1_CH1/I2C3_SCL/OTG_FS_SOF/EVENTOUT)
PA9: *#5.10 U?#2.120(PA9/USART1_TX/TIM1_CH2/I2C3_SMBA/DCMI_D0/EVENTOUT/OTG_FS_VBUS)
PA13: JTAG?.7(TMS/SWDIO) U?#2.124(PA13(JTMS-SWDIO)/JTMS-SWDIO/EVENTOUT)  [also labelled TMS]
PA14: JTAG?.9(TCK/SWCLK) U?#2.137(PA14(JTCK-SWCLK)/JTCK-SWCLK/EVENTOUT)  [also labelled TCK]
PA15: *#5.4 U?#2.138(PA15(JTDI)/JTDI/SPI3_NSS/I2S3_WS/TIM2_CH1_ETR/SPI1_NSS/EVENTOUT)
PB0: *#7.23(DATA1) U?#2.56(PB0/TIM3_CH3/TIM8_CH2N/OTG_HS_ULPI_D1/ETH_MII_RXD2/TIM1_CH2N/EVENTOUT/ADC12_IN8)  [also labelled ULPI_D1]
PB1: *#7.22(DATA2) U?#2.57(PB1/TIM3_CH4/TIM8_CH3N/OTG_HS_ULPI_D2/ETH_MII_RXD3/OTG_HS_INTN/TIM1_CH3N/EVENTOUT/ADC12_IN9)  [also labelled ULPI_D2]
PB3: *#6.18 U?#2.161(PB3(JTDO/TRACESWO)/JTDO/TRACESWO/SPI3_SCK/I2S3_CK/TIM2_CH2/SPI1_SCK/EVENTOUT)
PB4: *#6.16 U?#2.162(PB4(NJTRST)/NJTRST/SPI3_MISO/TIM3_CH1/SPI1_MISO/I2S3ext_SD/EVENTOUT)
PB5: *#6.14 *#7.17(DATA7) U?#2.163(PB5/I2C1_SMBA/CAN2_RX/OTG_HS_ULPI_D7/ETH_PPS_OUT/TIM3_CH2/SPI1_MOSI/SPI3_MOSI/DCMI_D10/I2S3_SD/EVENTOUT)  [also labelled ULPI_D7]
PB6: *#6.12 *#11.2(RX) U?#2.164(PB6/I2C1_SCL/TIM4_CH1/CAN2_TX/DCMI_D5/USART1_TX/EVENTOUT)  [also labelled USART1_TX]
PB7: *#6.10 *#11.1(TX) U?#2.165(PB7/I2C1_SDA/FSMC_NL/DCMI_VSYNC/USART1_RX/TIM4_CH2/EVENTOUT)  [also labelled USART1_RX]
PB8: *#6.8 U?#2.167(PB8/TIM4_CH3/SDIO_D4/TIM10_CH1/DCMI_D6/ETH_MII_TXD3/I2C1_SCL/CAN1_RX/EVENTOUT)
PB9: *#6.6 U?#2.168(PB9/SPI2_NSS/I2S2_WS/TIM4_CH4/TIM11_CH1/SDIO_D5/DCMI_D7/I2C1_SDA/CAN1_TX/EVENTOUT)
PB10: *#6.4 *#7.21(DATA3) U?#2.79(PB10/SPI2_SCK/I2S2_CK/I2C2_SCL/USART3_TX/OTG_HS_ULPI_D3/ETH_MII_RX_ER/TIM2_CH3/EVENTOUT)  [also labelled ULPI_D3]
PB11: *#6.2 *#7.20(DATA4) U?#2.80(PB11/I2C2_SDA/USART3_RX/OTG_HS_ULPI_D4/ETH_RMII_TX_EN/ETH_MII_TX_EN/TIM2_CH4/EVENTOUT)  [also labelled ULPI_D4]
PB14: *#6.15 U?#2.94(PB14/SPI2_MISO/TIM1_CH2N/TIM12_CH1/OTG_HS_DM/USART3_RTS/TIM8_CH2N/I2S2ext_SD/EVENTOUT)
PC0: *#7.13(STP) U?#1.32(PC0/OTG_HS_ULPI_STP/EVENTOUT/ADC123_IN10)  [also labelled ULPI_STP]
PC2: *#7.12(DIR) U?#1.34(PC2/SPI2_MISO/OTG_HS_ULPI_DIR/TH_MII_TXD2/I2S2ext_SD/EVENTOUT/ADC123_IN12)  [also labelled ULPI_DIR]
PC3: *#7.11(NXT) U?#1.35(PC3/SPI2_MOSI/I2S2_SD/OTG_HS_ULPI_NXT/ETH_MII_TX_CLK/EVENTOUT/ADC123_IN13)  [also labelled ULPI_NXT]
PC7: *#2.1(RST) C24#11.1 R19#5.1 U?#1.116(PC7/I2S3_MCK/TIM8_CH2/SDIO_D7/USART6_RX/DCMI_D1/TIM3_CH2/EVENTOUT)  [also labelled UDA_RST]
PC8: R3#5.2 SD_CARD?.7(DATA0) U?#1.117(PC8/TIM8_CH3/SDIO_D0/TIM3_CH3/USART6_CK/DCMI_D2/EVENTOUT)  [also labelled SD_DT0, SDIO D0]
PC9: R3#6.2 SD_CARD?.8(DATA1) U?#1.118(PC9/I2S_CKIN/MCO2/TIM8_CH4/SDIO_D1//I2C3_SDA/DCMI_D3/TIM3_CH4/EVENTOUT)  [also labelled SD_DT1, SDIO D1]
PC11: R3#8.2 SD_CARD?.1(CD/DATA3) U?#1.140(PC11/UART4_RX/SPI3_MISO/SDIO_D3/DCMI_D4/USART3_RX/I2S3ext_SD/EVENTOUT)  [also labelled SD_DT3, SDIO D3]
PC12: SD_CARD?.5(CLK) U?#1.141(PC12/UART5_TX/SDIO_CK/DCMI_D9/SPI3_MOSI/I2S3_SD/USART3_CK/EVENTOUT)  [also labelled SD_SCK, SDIO SCK]
PC13: U?#1.8(PC13/EVENTOUT/RTC_AF1)
PD2: R3#4.2 U?#1.144(PD2/TIM3_ETR/UART5_RX/SDIO_CMD/DCMI_D11/EVENTOUT)  [also labelled SD_CDM, SDIO CMD]
PD3: U?#1.145(PD3/FSMC_CLK/USART2_CTS/EVENTOUT)
PE2: U?#4.1(PE2/TRACECLK/FSMC_A23/ETH_MII_TXD3/EVENTOUT)
PF6: SD_CARD?.10(CD) U?#4.24(PF6/TIM10_CH1/FSMC_NIORD/EVENTOUT/ADC3_IN4)  [also labelled SD_DETECT]
PF7: *#5.2 U?#4.25(PF7/TIM11_CH1/FSMC_NREG/EVENTOUT/ADC3_IN5)
PF8: *#5.19 U?#4.26(PF8/TIM13_CH1/FSMC_NIOWR/EVENTOUT/ADC3_IN6)
PF9: *#5.17 U?#4.27(PF9/TIM14_CH1/FSMC_CD/EVENTOUT/ADC3_IN7)
PF10: *#5.15 U?#4.28(PF10/FSMC_INTR/EVENTOUT/ADC3_IN8)
PF11: *#5.13 U?#4.59(PF11/DCMI_12/EVENTOUT)
PG6: *#5.11 U?#5.110(PG6/FSMC_INT2/EVENTOUT)
PG7: *#5.9 U?#5.111(PG7/FSMC_INT3/USART6_CK/EVENTOUT)
PG8: *#5.7 U?#5.112(PG8/USART6_RTS/ETH_PPS_OUT/EVENTOUT)
PG9: *#5.5 U?#5.152(PG9/USART6_RX/FSMC_NE2/FSMC_NCE3/EVENTOUT)
PG15: *#5.3 U?#5.160(PG15/USART6_CTS/DCMI_D13/EVENTOUT)
PH2: *#6.11 U?#5.43(PH2/ETH_MII_CRS/EVENTOUT)
PH6: *#6.9 U?#5.83(PH6/I2C2_SMBA/TIM12_CH1/ETH_MII_RXD2/EVENTOUT)
PH13: U?#5.128(PH13/TIM8_CH1N/CAN1_TX/EVENTOUT)
PI0: 2.4'/2.8'LCD.33(T_CS) U?#3.131(PI0/TIM5_CH4/SPI2_NSS/I2S2_WS/DCMI_D13/EVENTOUT)  [also labelled T_CS]
PI1: 2.4'/2.8'LCD.34(CLK) U?#3.132(PI1/SPI2_SCK/I2S2_CK/DCMI_D8/EVENTOUT)  [also labelled T_SCK]
PI2: 2.4'/2.8'LCD.29(MISO) U?#3.133(PI2/TIM8_CH4/SPI2_MISO/DCMI_D9/I2S2ext_SD/EVENTOUT)  [also labelled T_MISO]
PI3: 2.4'/2.8'LCD.30(MOSI) U?#3.134(PI3/TIM8_ETR/SPI2_MOSI/I2S2_SD/DCMI_D10/EVENTOUT)  [also labelled T_MOSI]
PI5: *#8.5 U?#3.174(PI5/TIM8_CH1/DCMI_VSYNC/EVENTOUT)  [also labelled VSYNC]
PI8: U?#3.7(PI8/EVENTOUT/RTC_AF2)
PI9: U?#3.11(PI9/CAN1_RX/EVENTOUT)
PI10: U?#3.12(PI10/ETH_MII_RX_ER/EVENTOUT)
PI11: 2.4'/2.8'LCD.31(T_PEN) U?#3.13(PI11/OTG_HS_ULPI_DIR/EVENTOUT)  [also labelled T_PEN]
SCL: *#8.3
SD_CMD: SD_CARD?.2(CMD)
SDA: *#8.4
USB REST: *#7.9(REST)
Net8#1_1: 8#1.1(OSC1) *#7.27(XO) C8#1.1
Net8#1_2: 8#1.2(OSC2) *#7.28(X1) C7#1.1
Net8#2_1: 8#2.1(OSC1) *#10.5(XTAL1/CLKIN) C8#3.1
Net8#2_2: 8#2.2(OSC2) *#10.4(XTAL2) C7#3.1
Net*#1_1: *#1.1(L) C24#4.2
Net*#1_2: *#1.2(R) C24#6.2
Net*#2_2: *#2.2(VDD) C24#12.2 R19#7.1
Net*#2_12: *#2.12(L3MODE) *#2.15(SEL_L3_iic) R19#3.1
Net*#2_17: *#2.17(VOUTRHP) *#3.2(R)
Net*#2_18: *#2.18(VREF) *#3.3(TP)
Net*#2_19: *#2.19(VOUTLHP) *#3.1(L)
Net*#2_20: *#2.20(VDDA) *#2.22(VDDA) *#2.28(VDDA) C24#1.1 C24#2.1 C24#3.1 C24#5.1 C24#7.1 C24#8.1 L1#2.1 R19#6.2
Net*#2_25: *#2.25(VREF) C24#9.1 C24#10.1
Net*#2_27: *#2.27(VINL) C24#4.1
Net*#2_29: *#2.29(VINR) C24#6.1
Net*#2_32: *#2.32(VADCP) C24#13.2 C24#14.2 R19#6.1
Net*#4_1: *#4.1(CTLA) *#7.3(CPEN)
Net*#4_2: *#4.2(FLGA) *#7.10(EXTVBUS)
Net*#4_8: *#4.8(OUTA) *#7.4(VBUS) C24#28.1 D1#2.1 DS2#2.1(A) USB_HOST.1(VCC) USB_HS.1(VCC)
Net*#7_5: *#7.5(ID) USB_HS.4(NC)
Net*#7_7: *#7.7(DP) USB_HOST.3(D+) USB_HS.3(D+)
Net*#7_8: *#7.8(DM) USB_HOST.2(D-) USB_HS.2(D-)
Net*#7_15: *#7.15(VDD1.8) *#7.26(VDD1.8) C23#2.2 C24#30.1
Net*#7_29: *#7.29(VDDA_1.8) C23#1.1 C24#29.2
Net*#7_32: *#7.32(RBIAS) R3#1.1
Net*#9_19: *#9.19(WP) R2#4.2
Net*#10_3: *#10.3(LED1/REGOFF) J7.9(L+)
Net*#10_6: *#10.6(VDDCR) C1#4.2 C23#5.1
Net*#10_20: *#10.20(TXN) C24#39.2 J7.2 R19#14.2
Net*#10_21: *#10.21(TXP) C24#38.2 J7.1 R19#16.2
Net*#10_22: *#10.22(RXN) C24#41.2 J7.6 R19#12.2
Net*#10_23: *#10.23(RXP) C24#40.2 J7.3 R19#13.2
Net*#10_24: *#10.24(RBIAS) R19#22.2
Net*#10_49: *#10.49(LED2/n1NTSEL) J7.12(R+) R19#21.2
Net*#11_24: *#11.24(STATE) D1#3.1(A)
Net*#11_28: *#11.28(MS) R2#5.2 R3#3.2
NetC3_2: C3.2 U?#3.81(VCAP_1)
NetC4_2: C4.2 U?#3.125(VCAP_2)
NetC22#1_1: C22#1.1 L1#3.2 U?#6.38(VREF+) U?#6.39(VDDA)
NetC23#3_1: C23#3.1 C24#34.2 SAFE1.1 U2.2(OUT) U2.4(OUT)
NetD1#3_2: D1#3.2(K) R5.2
NetDC_IN_1: DC_IN.1 K1.1 POWER.1
NetDS2#1_2: DS2#1.2(K) R19#10.1
NetDS2#2_2: DS2#2.2(K) R19#11.1
NetDS2#3_2: DS2#3.2(K) R19#18.1
NetJ7_10: J7.10(L-) R19#17.2
NetJ7_11: J7.11(R-) R19#19.2
NetP?_3: P?.3 R2#6.2
NetP?_4: P?.4 R2#7.1
NetR19#8_2: R19#8.2 USB_FS.2(D-)
NetR19#9_2: R19#9.2 USB_FS.3(D+)

Not connected (* = marked no-connect by the designer): 2.4'/2.8'LCD 32(MO); *#2 21(VOUTR) 23(VOUTL) 31(VINM); *#6 3; *#8 2 6 7 10; *#10 10(RXER/PHYAD0); JTAG? 3(TRST) 5(TDI) 11(NC) 13(TDO/SWO) 15(RESET#) 17(NC) 19(NC); K1 3; SD_CARD? 12(WP); TP?#1 1; TP?#2 1; TP?#3 1; TP?#4 1; USB_HOST 4(NC)

## Notes on the sheet
- USB
- DASHI
- KEY
- CAM
- PW
- TFT
- RAM
- NAND FLASH
- LAN
- JTAG
- 25MHZ
- LED
- REST
- SD
- buletooth
- 32.768khz
- BOOT0
- Labels drawn without touching a wire or pin: OTG_FS_CURRENT, OTG_FS_POWER, USB REST
- (in symbol HR911102) TD+; 1 TX+; TD-; 2 TX-; RD+; 3 RX+; RD-; 6 RX-; Green; 7; 8; Yellow; ETH

## Library data of the parts
2.4'/2.8'LCD = T
3.3V 5V GND = Header 8: Header, 8-Pin; LatestRevisionDate: 17-Jul-2002; LatestRevisionNote: Re-released for DXP Platform.; Publisher: Altium Limited
8#1-8#3 Y? = XTAL: Crystal Oscillator; Published: 8-Jun-2000; LatestRevisionDate: 17-Jul-2002; LatestRevisionNote: Re-released for DXP Platform.; Publisher: Altium Limited
*#4 = AIC1526
C1#1-C1#4 C2-C4 C7#1-C7#4 C8#1-C8#4 C22#1-C22#3 C24#1-C24#45 SAFE1 = Cap: Capacitor; Published: 8-Jun-2000; LatestRevisionDate: 17-Jul-2002; LatestRevisionNote: Re-released for DXP Platform.; PackageReference: RAD-0.3; Publisher: Altium Limited
C23#1-C23#6 = Cap Pol1: Polarized Capacitor (Radial); Published: 8-Jun-2000; LatestRevisionDate: 17-Jul-2002; LatestRevisionNote: Re-released for DXP Platform.; PackageReference: RB7.6-15; Publisher: Altium Limited
D1#1 D1#2 = D
D1#3 DS2#1-DS2#3 = LED2: Typical RED, GREEN, YELLOW, AMBER GaAs LED; Published: 8-Jun-2000; LatestRevisionDate: 17-Jul-2002; LatestRevisionNote: Re-released for DXP Platform.; PackageReference: 3.2X1.6X1.1; Publisher: Altium Limited
  D1#3: PackageVersion: Feb-2002
  DS2#1-DS2#3: PackageDocument: Feb-2002
DC_IN = POW
J7 = HR911102
K1 = Header 3: Header, 3-Pin; LatestRevisionDate: 17-Jul-2002; LatestRevisionNote: Re-released for DXP Platform.; Publisher: Altium Limited
L1#1-L1#3 R2#1-R2#7 R3#1-R3#8 R5 R19#1-R19#22 = Res2: Resistor; Published: 8-Jun-2000; LatestRevisionDate: 17-Jul-2002; LatestRevisionNote: Re-released for DXP Platform.; PackageReference: AXIAL-0.4; Publisher: Altium Limited
P? = Header 3X2: Header, 3-Pin, Dual row; LatestRevisionDate: 17-Jul-2002; LatestRevisionNote: Re-released for DXP Platform.; Publisher: Altium Limited
POWER = Header 2: Header, 2-Pin; LatestRevisionDate: 17-Jul-2002; LatestRevisionNote: Re-released for DXP Platform.; Publisher: Altium Limited
TP?#1-TP?#4 = TEST-POI: 测试点
U1 U2 = REG1117-3.3: 800mA and 1A Low Dropout Positive Regulator 2.85V, 3.3V, 5V, and Adjustable; Published: 8-Jun-2000; LatestRevisionDate: 17-Jul-2002; LatestRevisionNote: Re-released for DXP Platform.; DatasheetVersion: Sep-1997; PackageVersion: revC; PackageReference: ZZ311; Publisher: Altium Limited; PackageDescription: SOT-223/SC-73; 4 Leads; Body 6.7 x 7.3 mm, inc. leads (LxW max); ComponentLink1Description: Manufacturer Link; ComponentLink1URL: http://www.ti.com/; ComponentLink2Description: Datasheet; ComponentLink2URL: http://www-s.ti.com/sc/ds/REG1117.pdf
U?#1-U?#6 = STM32F407IGT6: ARM Cortex-M4 32b MCU+FPU, 210DMIP, 1024 kB Flash, 192+4 kB RAM, Camera, 140 I/Os, 176-pin LQFP, -40 to +85°C, Tray; Internal RAM: 192kB; Operating Frequency (Processor Speed): 168MHz; A/D Converter: 24x12-bit; D/A Converter: 2x12-bit; 16-bit Timers (IC/OC/PWM): 12x16-bit(24/24/30); 32-bit Timer (IC/OC/PWM): 2x32-bit (8/8/8); Other Timer Functions: 2xWDG, RTC, 24-bit down counter; Serial Interface: 3xSPI/2xI2S/2xI2C/3xUSART(IrDa, ISO7816)/3xUART/2xUSB OTG FS/HS, 2xCAN/Ethernet MAC10/100, SDIO; DatasheetVersion: rev2, Jan-2012; PackageVersion: 2012; PackageReference: LQFP176; PackageDescription: 176-Pin Low Profile Quad Flat Package, 24 x 24 mm Body, 0.5 mm Pitch; ComponentLink1Description: Manufacturer URL; ComponentLink1URL: http://www.st.com/; ComponentLink2Description: STM32F405/7 Datasheet; ComponentLink2URL: http://www.st.com/internet/com/TECHNICAL_RESOURCES/TECHNICAL_LITERATURE/DATASHEET/DM00037051.pdf; ComponentLink3Description: STM32F4 Web Page; ComponentLink3URL: http://www.st.com/internet/mcu/subclass/1521.jsp
U?#7 = IS61LV51216
USB_FS USB_HOST USB_HS = USB5